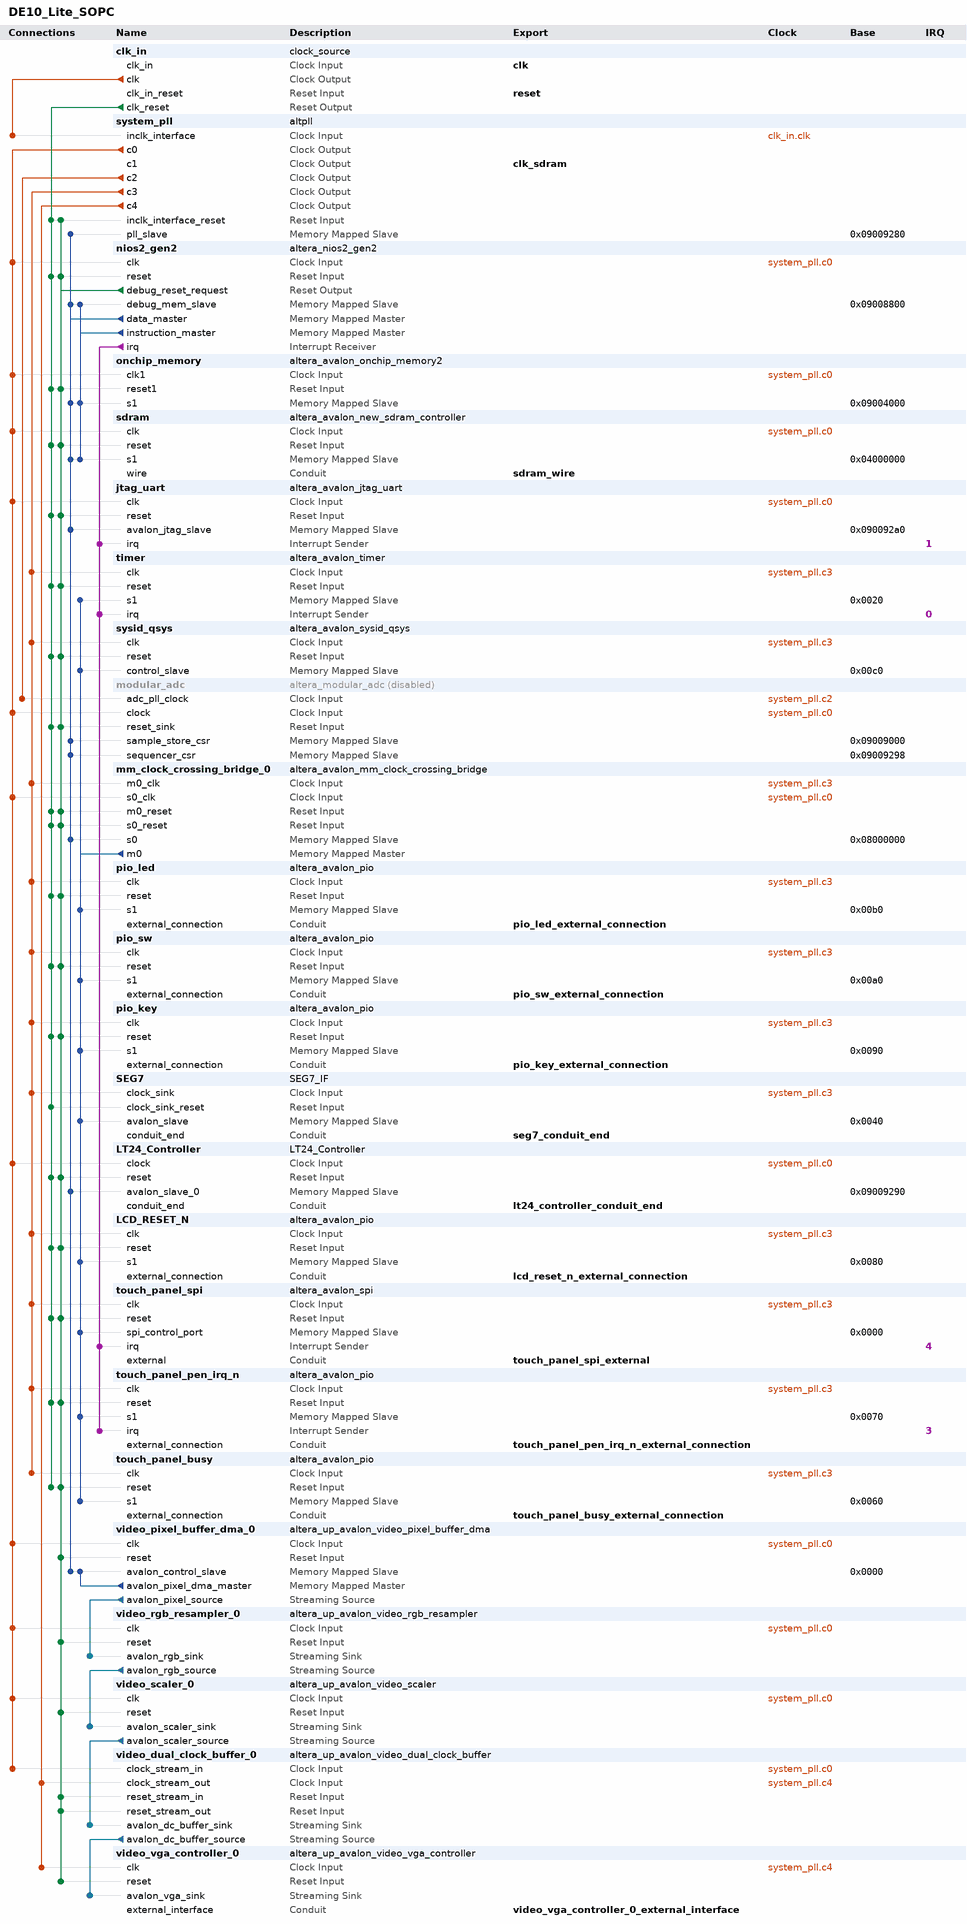
[diagram p0: system contents]
# Platform Designer (Qsys) system DE10_Lite_SOPC, MAX 10 10M50DAF484C7G
# Parameters at their usual value, and those the tool derives, are not listed.
package require -exact qsys 18.1
create_system DE10_Lite_SOPC
set_project_property DEVICE_FAMILY {MAX 10}
set_project_property DEVICE 10M50DAF484C7G

add_instance clk_in clock_source 18.1
set_instance_parameter_value clk_in clockFrequency 50000000

add_instance system_pll altpll 18.1
set_instance_parameter_value system_pll CLK0_DIVIDE_BY 1
set_instance_parameter_value system_pll CLK0_MULTIPLY_BY 2
set_instance_parameter_value system_pll CLK1_DIVIDE_BY 1
set_instance_parameter_value system_pll CLK1_DUTY_CYCLE 50
set_instance_parameter_value system_pll CLK1_MULTIPLY_BY 2
set_instance_parameter_value system_pll CLK1_PHASE_SHIFT -3000
set_instance_parameter_value system_pll CLK2_DIVIDE_BY 5
set_instance_parameter_value system_pll CLK2_DUTY_CYCLE 50
set_instance_parameter_value system_pll CLK2_MULTIPLY_BY 1
set_instance_parameter_value system_pll CLK2_PHASE_SHIFT 0
set_instance_parameter_value system_pll CLK3_DIVIDE_BY 5
set_instance_parameter_value system_pll CLK3_DUTY_CYCLE 50
set_instance_parameter_value system_pll CLK3_MULTIPLY_BY 1
set_instance_parameter_value system_pll CLK3_PHASE_SHIFT 0
set_instance_parameter_value system_pll CLK4_DIVIDE_BY 2
set_instance_parameter_value system_pll CLK4_DUTY_CYCLE 50
set_instance_parameter_value system_pll CLK4_MULTIPLY_BY 1
set_instance_parameter_value system_pll CLK4_PHASE_SHIFT 0
set_instance_parameter_value system_pll INCLK0_INPUT_FREQUENCY 20000
set_instance_parameter_value system_pll PORT_ARESET PORT_UNUSED
set_instance_parameter_value system_pll PORT_LOCKED PORT_UNUSED
set_instance_parameter_value system_pll PORT_clk1 PORT_USED
set_instance_parameter_value system_pll PORT_clk2 PORT_USED
set_instance_parameter_value system_pll PORT_clk3 PORT_USED
set_instance_parameter_value system_pll PORT_clk4 PORT_USED

add_instance nios2_gen2 altera_nios2_gen2 18.1
set_instance_parameter_value nios2_gen2 dcache_size 2048
set_instance_parameter_value nios2_gen2 exceptionOffset 4194304
set_instance_parameter_value nios2_gen2 exceptionSlave sdram.s1
set_instance_parameter_value nios2_gen2 icache_size 4096
set_instance_parameter_value nios2_gen2 impl Fast
set_instance_parameter_value nios2_gen2 resetSlave onchip_memory.s1

add_instance onchip_memory altera_avalon_onchip_memory2 18.1
set_instance_parameter_value onchip_memory dataWidth 32
set_instance_parameter_value onchip_memory dualPort false
set_instance_parameter_value onchip_memory initMemContent true
set_instance_parameter_value onchip_memory initializationFileName onchip_mem.hex
set_instance_parameter_value onchip_memory memorySize 12288

add_instance sdram altera_avalon_new_sdram_controller 18.1
set_instance_parameter_value sdram TAC 5.4
set_instance_parameter_value sdram TRCD 15.0
set_instance_parameter_value sdram TRP 15.0
set_instance_parameter_value sdram casLatency 3
set_instance_parameter_value sdram columnWidth 10
set_instance_parameter_value sdram dataWidth 16
set_instance_parameter_value sdram generateSimulationModel false
set_instance_parameter_value sdram model single_Micron_MT48LC4M32B2_7_chip
set_instance_parameter_value sdram numberOfBanks 4
set_instance_parameter_value sdram numberOfChipSelects 1
set_instance_parameter_value sdram powerUpDelay 100.0
set_instance_parameter_value sdram refreshPeriod 7.8125
set_instance_parameter_value sdram rowWidth 13

add_instance jtag_uart altera_avalon_jtag_uart 18.1
set_instance_parameter_value jtag_uart simInteractiveOptions NO_INTERACTIVE_WINDOWS

add_instance timer altera_avalon_timer 18.1
set_instance_parameter_value timer period 1
set_instance_parameter_value timer periodUnits MSEC

add_instance sysid_qsys altera_avalon_sysid_qsys 18.1
set_instance_parameter_value sysid_qsys id 0

add_instance modular_adc altera_modular_adc 18.1
set_instance_property modular_adc ENABLED false
set_instance_parameter_value modular_adc CLOCK_FREQ 120000000
set_instance_parameter_value modular_adc CORE_VAR 0
set_instance_parameter_value modular_adc DEVICE_PART 10M50DAF484C7G
set_instance_parameter_value modular_adc clkdiv 2
set_instance_parameter_value modular_adc int_vref_vr 3.0
set_instance_parameter_value modular_adc refsel 0
set_instance_parameter_value modular_adc sample_rate 0
set_instance_parameter_value modular_adc seq_order_length 9
set_instance_parameter_value modular_adc seq_order_slot_1 1
set_instance_parameter_value modular_adc seq_order_slot_2 2
set_instance_parameter_value modular_adc seq_order_slot_3 3
set_instance_parameter_value modular_adc seq_order_slot_4 4
set_instance_parameter_value modular_adc seq_order_slot_5 5
set_instance_parameter_value modular_adc seq_order_slot_6 6
set_instance_parameter_value modular_adc seq_order_slot_7 7
set_instance_parameter_value modular_adc seq_order_slot_8 8
set_instance_parameter_value modular_adc seq_order_slot_9 17
set_instance_parameter_value modular_adc use_ch0 false
set_instance_parameter_value modular_adc use_ch2 true
set_instance_parameter_value modular_adc use_ch3 true
set_instance_parameter_value modular_adc use_ch4 true
set_instance_parameter_value modular_adc use_ch5 true
set_instance_parameter_value modular_adc use_ch6 true
set_instance_parameter_value modular_adc use_ch7 true
set_instance_parameter_value modular_adc use_ch8 true
set_instance_parameter_value modular_adc use_tsd true

add_instance mm_clock_crossing_bridge_0 altera_avalon_mm_clock_crossing_bridge 18.1
set_instance_parameter_value mm_clock_crossing_bridge_0 ADDRESS_WIDTH 10
set_instance_parameter_value mm_clock_crossing_bridge_0 COMMAND_FIFO_DEPTH 8
set_instance_parameter_value mm_clock_crossing_bridge_0 DATA_WIDTH 32
set_instance_parameter_value mm_clock_crossing_bridge_0 MASTER_SYNC_DEPTH 2
set_instance_parameter_value mm_clock_crossing_bridge_0 MAX_BURST_SIZE 1
set_instance_parameter_value mm_clock_crossing_bridge_0 RESPONSE_FIFO_DEPTH 8
set_instance_parameter_value mm_clock_crossing_bridge_0 SLAVE_SYNC_DEPTH 2
set_instance_parameter_value mm_clock_crossing_bridge_0 USE_AUTO_ADDRESS_WIDTH 0

add_instance pio_led altera_avalon_pio 18.1
set_instance_parameter_value pio_led direction Output
set_instance_parameter_value pio_led width 10

add_instance pio_sw altera_avalon_pio 18.1
set_instance_parameter_value pio_sw direction Input
set_instance_parameter_value pio_sw width 10

add_instance pio_key altera_avalon_pio 18.1
set_instance_parameter_value pio_key direction Input
set_instance_parameter_value pio_key width 2

add_instance SEG7 SEG7_IF 1.0
set_instance_parameter_value SEG7 SEG7_NUM 6

add_instance LT24_Controller LT24_Controller 1.0

add_instance LCD_RESET_N altera_avalon_pio 18.1
set_instance_parameter_value LCD_RESET_N direction Output
set_instance_parameter_value LCD_RESET_N width 1

add_instance touch_panel_spi altera_avalon_spi 18.1
set_instance_parameter_value touch_panel_spi clockPolarity 0
set_instance_parameter_value touch_panel_spi dataWidth 8
set_instance_parameter_value touch_panel_spi masterSPI true
set_instance_parameter_value touch_panel_spi numberOfSlaves 1
set_instance_parameter_value touch_panel_spi targetClockRate 32000

add_instance touch_panel_pen_irq_n altera_avalon_pio 18.1
set_instance_parameter_value touch_panel_pen_irq_n captureEdge true
set_instance_parameter_value touch_panel_pen_irq_n direction Input
set_instance_parameter_value touch_panel_pen_irq_n edgeType FALLING
set_instance_parameter_value touch_panel_pen_irq_n generateIRQ true
set_instance_parameter_value touch_panel_pen_irq_n irqType EDGE
set_instance_parameter_value touch_panel_pen_irq_n width 1

add_instance touch_panel_busy altera_avalon_pio 18.1
set_instance_parameter_value touch_panel_busy direction Input
set_instance_parameter_value touch_panel_busy width 1

add_instance video_pixel_buffer_dma_0 altera_up_avalon_video_pixel_buffer_dma 18.0
set_instance_parameter_value video_pixel_buffer_dma_0 addr_mode X-Y
set_instance_parameter_value video_pixel_buffer_dma_0 back_start_address 0
set_instance_parameter_value video_pixel_buffer_dma_0 color_space {9-bit RGB}
set_instance_parameter_value video_pixel_buffer_dma_0 image_height 480
set_instance_parameter_value video_pixel_buffer_dma_0 image_width 640
set_instance_parameter_value video_pixel_buffer_dma_0 start_address 0

add_instance video_rgb_resampler_0 altera_up_avalon_video_rgb_resampler 18.0
set_instance_parameter_value video_rgb_resampler_0 alpha 1023
set_instance_parameter_value video_rgb_resampler_0 input_type {9-bit RGB}
set_instance_parameter_value video_rgb_resampler_0 output_type {30-bit RGB}

add_instance video_scaler_0 altera_up_avalon_video_scaler 18.0
set_instance_parameter_value video_scaler_0 color_bits 10
set_instance_parameter_value video_scaler_0 color_planes 3
set_instance_parameter_value video_scaler_0 height_scaling 2
set_instance_parameter_value video_scaler_0 width_in 320
set_instance_parameter_value video_scaler_0 width_scaling 2

add_instance video_dual_clock_buffer_0 altera_up_avalon_video_dual_clock_buffer 18.0
set_instance_parameter_value video_dual_clock_buffer_0 color_bits 10

add_instance video_vga_controller_0 altera_up_avalon_video_vga_controller 18.0
set_instance_parameter_value video_vga_controller_0 board DE10-Lite
set_instance_parameter_value video_vga_controller_0 resolution {VGA 640x480}

# connections
add_connection clk_in.clk system_pll.inclk_interface clock
add_connection system_pll.c0 jtag_uart.clk clock
add_connection system_pll.c0 LT24_Controller.clock clock
add_connection system_pll.c0 mm_clock_crossing_bridge_0.s0_clk clock
add_connection system_pll.c0 modular_adc.clock clock
add_connection system_pll.c0 nios2_gen2.clk clock
add_connection system_pll.c0 onchip_memory.clk1 clock
add_connection system_pll.c0 sdram.clk clock
add_connection system_pll.c0 video_dual_clock_buffer_0.clock_stream_in clock
add_connection system_pll.c0 video_pixel_buffer_dma_0.clk clock
add_connection system_pll.c0 video_rgb_resampler_0.clk clock
add_connection system_pll.c0 video_scaler_0.clk clock
add_connection system_pll.c2 modular_adc.adc_pll_clock clock
add_connection system_pll.c3 LCD_RESET_N.clk clock
add_connection system_pll.c3 mm_clock_crossing_bridge_0.m0_clk clock
add_connection system_pll.c3 pio_key.clk clock
add_connection system_pll.c3 pio_led.clk clock
add_connection system_pll.c3 pio_sw.clk clock
add_connection system_pll.c3 SEG7.clock_sink clock
add_connection system_pll.c3 sysid_qsys.clk clock
add_connection system_pll.c3 timer.clk clock
add_connection system_pll.c3 touch_panel_busy.clk clock
add_connection system_pll.c3 touch_panel_pen_irq_n.clk clock
add_connection system_pll.c3 touch_panel_spi.clk clock
add_connection system_pll.c4 video_dual_clock_buffer_0.clock_stream_out clock
add_connection system_pll.c4 video_vga_controller_0.clk clock
add_connection clk_in.clk_reset jtag_uart.reset reset
add_connection clk_in.clk_reset LCD_RESET_N.reset reset
add_connection clk_in.clk_reset LT24_Controller.reset reset
add_connection clk_in.clk_reset mm_clock_crossing_bridge_0.m0_reset reset
add_connection clk_in.clk_reset mm_clock_crossing_bridge_0.s0_reset reset
add_connection clk_in.clk_reset modular_adc.reset_sink reset
add_connection clk_in.clk_reset nios2_gen2.reset reset
add_connection clk_in.clk_reset onchip_memory.reset1 reset
add_connection clk_in.clk_reset pio_key.reset reset
add_connection clk_in.clk_reset pio_led.reset reset
add_connection clk_in.clk_reset pio_sw.reset reset
add_connection clk_in.clk_reset sdram.reset reset
add_connection clk_in.clk_reset SEG7.clock_sink_reset reset
add_connection clk_in.clk_reset sysid_qsys.reset reset
add_connection clk_in.clk_reset system_pll.inclk_interface_reset reset
add_connection clk_in.clk_reset timer.reset reset
add_connection clk_in.clk_reset touch_panel_busy.reset reset
add_connection clk_in.clk_reset touch_panel_pen_irq_n.reset reset
add_connection clk_in.clk_reset touch_panel_spi.reset reset
add_connection nios2_gen2.debug_reset_request jtag_uart.reset reset
add_connection nios2_gen2.debug_reset_request LCD_RESET_N.reset reset
add_connection nios2_gen2.debug_reset_request LT24_Controller.reset reset
add_connection nios2_gen2.debug_reset_request mm_clock_crossing_bridge_0.m0_reset reset
add_connection nios2_gen2.debug_reset_request mm_clock_crossing_bridge_0.s0_reset reset
add_connection nios2_gen2.debug_reset_request modular_adc.reset_sink reset
add_connection nios2_gen2.debug_reset_request nios2_gen2.reset reset
add_connection nios2_gen2.debug_reset_request onchip_memory.reset1 reset
add_connection nios2_gen2.debug_reset_request pio_key.reset reset
add_connection nios2_gen2.debug_reset_request pio_led.reset reset
add_connection nios2_gen2.debug_reset_request pio_sw.reset reset
add_connection nios2_gen2.debug_reset_request sdram.reset reset
add_connection nios2_gen2.debug_reset_request sysid_qsys.reset reset
add_connection nios2_gen2.debug_reset_request system_pll.inclk_interface_reset reset
add_connection nios2_gen2.debug_reset_request timer.reset reset
add_connection nios2_gen2.debug_reset_request touch_panel_busy.reset reset
add_connection nios2_gen2.debug_reset_request touch_panel_pen_irq_n.reset reset
add_connection nios2_gen2.debug_reset_request touch_panel_spi.reset reset
add_connection nios2_gen2.debug_reset_request video_dual_clock_buffer_0.reset_stream_in reset
add_connection nios2_gen2.debug_reset_request video_dual_clock_buffer_0.reset_stream_out reset
add_connection nios2_gen2.debug_reset_request video_pixel_buffer_dma_0.reset reset
add_connection nios2_gen2.debug_reset_request video_rgb_resampler_0.reset reset
add_connection nios2_gen2.debug_reset_request video_scaler_0.reset reset
add_connection nios2_gen2.debug_reset_request video_vga_controller_0.reset reset
add_connection mm_clock_crossing_bridge_0.m0 LCD_RESET_N.s1 avalon
set_connection_parameter_value mm_clock_crossing_bridge_0.m0/LCD_RESET_N.s1 baseAddress 0x0080
add_connection mm_clock_crossing_bridge_0.m0 pio_key.s1 avalon
set_connection_parameter_value mm_clock_crossing_bridge_0.m0/pio_key.s1 baseAddress 0x0090
add_connection mm_clock_crossing_bridge_0.m0 pio_led.s1 avalon
set_connection_parameter_value mm_clock_crossing_bridge_0.m0/pio_led.s1 baseAddress 0x00b0
add_connection mm_clock_crossing_bridge_0.m0 pio_sw.s1 avalon
set_connection_parameter_value mm_clock_crossing_bridge_0.m0/pio_sw.s1 baseAddress 0x00a0
add_connection mm_clock_crossing_bridge_0.m0 SEG7.avalon_slave avalon
set_connection_parameter_value mm_clock_crossing_bridge_0.m0/SEG7.avalon_slave baseAddress 0x0040
add_connection mm_clock_crossing_bridge_0.m0 sysid_qsys.control_slave avalon
set_connection_parameter_value mm_clock_crossing_bridge_0.m0/sysid_qsys.control_slave baseAddress 0x00c0
add_connection mm_clock_crossing_bridge_0.m0 timer.s1 avalon
set_connection_parameter_value mm_clock_crossing_bridge_0.m0/timer.s1 baseAddress 0x0020
add_connection mm_clock_crossing_bridge_0.m0 touch_panel_busy.s1 avalon
set_connection_parameter_value mm_clock_crossing_bridge_0.m0/touch_panel_busy.s1 baseAddress 0x0060
add_connection mm_clock_crossing_bridge_0.m0 touch_panel_pen_irq_n.s1 avalon
set_connection_parameter_value mm_clock_crossing_bridge_0.m0/touch_panel_pen_irq_n.s1 baseAddress 0x0070
add_connection mm_clock_crossing_bridge_0.m0 touch_panel_spi.spi_control_port avalon
set_connection_parameter_value mm_clock_crossing_bridge_0.m0/touch_panel_spi.spi_control_port baseAddress 0x0000
add_connection nios2_gen2.data_master jtag_uart.avalon_jtag_slave avalon
set_connection_parameter_value nios2_gen2.data_master/jtag_uart.avalon_jtag_slave baseAddress 0x090092a0
add_connection nios2_gen2.data_master LT24_Controller.avalon_slave_0 avalon
set_connection_parameter_value nios2_gen2.data_master/LT24_Controller.avalon_slave_0 baseAddress 0x09009290
add_connection nios2_gen2.data_master mm_clock_crossing_bridge_0.s0 avalon
set_connection_parameter_value nios2_gen2.data_master/mm_clock_crossing_bridge_0.s0 baseAddress 0x08000000
add_connection nios2_gen2.data_master modular_adc.sample_store_csr avalon
set_connection_parameter_value nios2_gen2.data_master/modular_adc.sample_store_csr baseAddress 0x09009000
add_connection nios2_gen2.data_master modular_adc.sequencer_csr avalon
set_connection_parameter_value nios2_gen2.data_master/modular_adc.sequencer_csr baseAddress 0x09009298
add_connection nios2_gen2.data_master nios2_gen2.debug_mem_slave avalon
set_connection_parameter_value nios2_gen2.data_master/nios2_gen2.debug_mem_slave baseAddress 0x09008800
add_connection nios2_gen2.data_master onchip_memory.s1 avalon
set_connection_parameter_value nios2_gen2.data_master/onchip_memory.s1 baseAddress 0x09004000
add_connection nios2_gen2.data_master sdram.s1 avalon
set_connection_parameter_value nios2_gen2.data_master/sdram.s1 baseAddress 0x04000000
add_connection nios2_gen2.data_master system_pll.pll_slave avalon
set_connection_parameter_value nios2_gen2.data_master/system_pll.pll_slave baseAddress 0x09009280
add_connection nios2_gen2.data_master video_pixel_buffer_dma_0.avalon_control_slave avalon
set_connection_parameter_value nios2_gen2.data_master/video_pixel_buffer_dma_0.avalon_control_slave baseAddress 0x0000
add_connection nios2_gen2.instruction_master nios2_gen2.debug_mem_slave avalon
set_connection_parameter_value nios2_gen2.instruction_master/nios2_gen2.debug_mem_slave baseAddress 0x09008800
add_connection nios2_gen2.instruction_master onchip_memory.s1 avalon
set_connection_parameter_value nios2_gen2.instruction_master/onchip_memory.s1 baseAddress 0x09004000
add_connection nios2_gen2.instruction_master sdram.s1 avalon
set_connection_parameter_value nios2_gen2.instruction_master/sdram.s1 baseAddress 0x04000000
add_connection video_pixel_buffer_dma_0.avalon_pixel_dma_master video_pixel_buffer_dma_0.avalon_control_slave avalon
set_connection_parameter_value video_pixel_buffer_dma_0.avalon_pixel_dma_master/video_pixel_buffer_dma_0.avalon_control_slave baseAddress 0x0000
add_connection video_dual_clock_buffer_0.avalon_dc_buffer_source video_vga_controller_0.avalon_vga_sink avalon_streaming
add_connection video_pixel_buffer_dma_0.avalon_pixel_source video_rgb_resampler_0.avalon_rgb_sink avalon_streaming
add_connection video_rgb_resampler_0.avalon_rgb_source video_scaler_0.avalon_scaler_sink avalon_streaming
add_connection video_scaler_0.avalon_scaler_source video_dual_clock_buffer_0.avalon_dc_buffer_sink avalon_streaming
add_connection nios2_gen2.irq jtag_uart.irq interrupt
set_connection_parameter_value nios2_gen2.irq/jtag_uart.irq irqNumber 1
add_connection nios2_gen2.irq timer.irq interrupt
set_connection_parameter_value nios2_gen2.irq/timer.irq irqNumber 0
add_connection nios2_gen2.irq touch_panel_pen_irq_n.irq interrupt
set_connection_parameter_value nios2_gen2.irq/touch_panel_pen_irq_n.irq irqNumber 3
add_connection nios2_gen2.irq touch_panel_spi.irq interrupt
set_connection_parameter_value nios2_gen2.irq/touch_panel_spi.irq irqNumber 4

# exported interfaces
add_interface clk clock sink
set_interface_property clk EXPORT_OF clk_in.clk_in
add_interface clk_sdram clock source
set_interface_property clk_sdram EXPORT_OF system_pll.c1
add_interface lcd_reset_n_external_connection conduit end
set_interface_property lcd_reset_n_external_connection EXPORT_OF LCD_RESET_N.external_connection
add_interface lt24_controller_conduit_end conduit end
set_interface_property lt24_controller_conduit_end EXPORT_OF LT24_Controller.conduit_end
add_interface pio_key_external_connection conduit end
set_interface_property pio_key_external_connection EXPORT_OF pio_key.external_connection
add_interface pio_led_external_connection conduit end
set_interface_property pio_led_external_connection EXPORT_OF pio_led.external_connection
add_interface pio_sw_external_connection conduit end
set_interface_property pio_sw_external_connection EXPORT_OF pio_sw.external_connection
add_interface reset reset sink
set_interface_property reset EXPORT_OF clk_in.clk_in_reset
add_interface sdram_wire conduit end
set_interface_property sdram_wire EXPORT_OF sdram.wire
add_interface seg7_conduit_end conduit end
set_interface_property seg7_conduit_end EXPORT_OF SEG7.conduit_end
add_interface touch_panel_busy_external_connection conduit end
set_interface_property touch_panel_busy_external_connection EXPORT_OF touch_panel_busy.external_connection
add_interface touch_panel_pen_irq_n_external_connection conduit end
set_interface_property touch_panel_pen_irq_n_external_connection EXPORT_OF touch_panel_pen_irq_n.external_connection
add_interface touch_panel_spi_external conduit end
set_interface_property touch_panel_spi_external EXPORT_OF touch_panel_spi.external
add_interface video_vga_controller_0_external_interface conduit end
set_interface_property video_vga_controller_0_external_interface EXPORT_OF video_vga_controller_0.external_interface

set_interconnect_requirement {$system} qsys_mm.clockCrossingAdapter HANDSHAKE
set_interconnect_requirement {$system} qsys_mm.enableEccProtection FALSE
set_interconnect_requirement {$system} qsys_mm.insertDefaultSlave FALSE
set_interconnect_requirement {$system} qsys_mm.maxAdditionalLatency 1

save_system DE10_Lite_SOPC.qsys
